# EAGLE design tinynumitronboard-extended_iv6 (EAGLE 7.7.0)
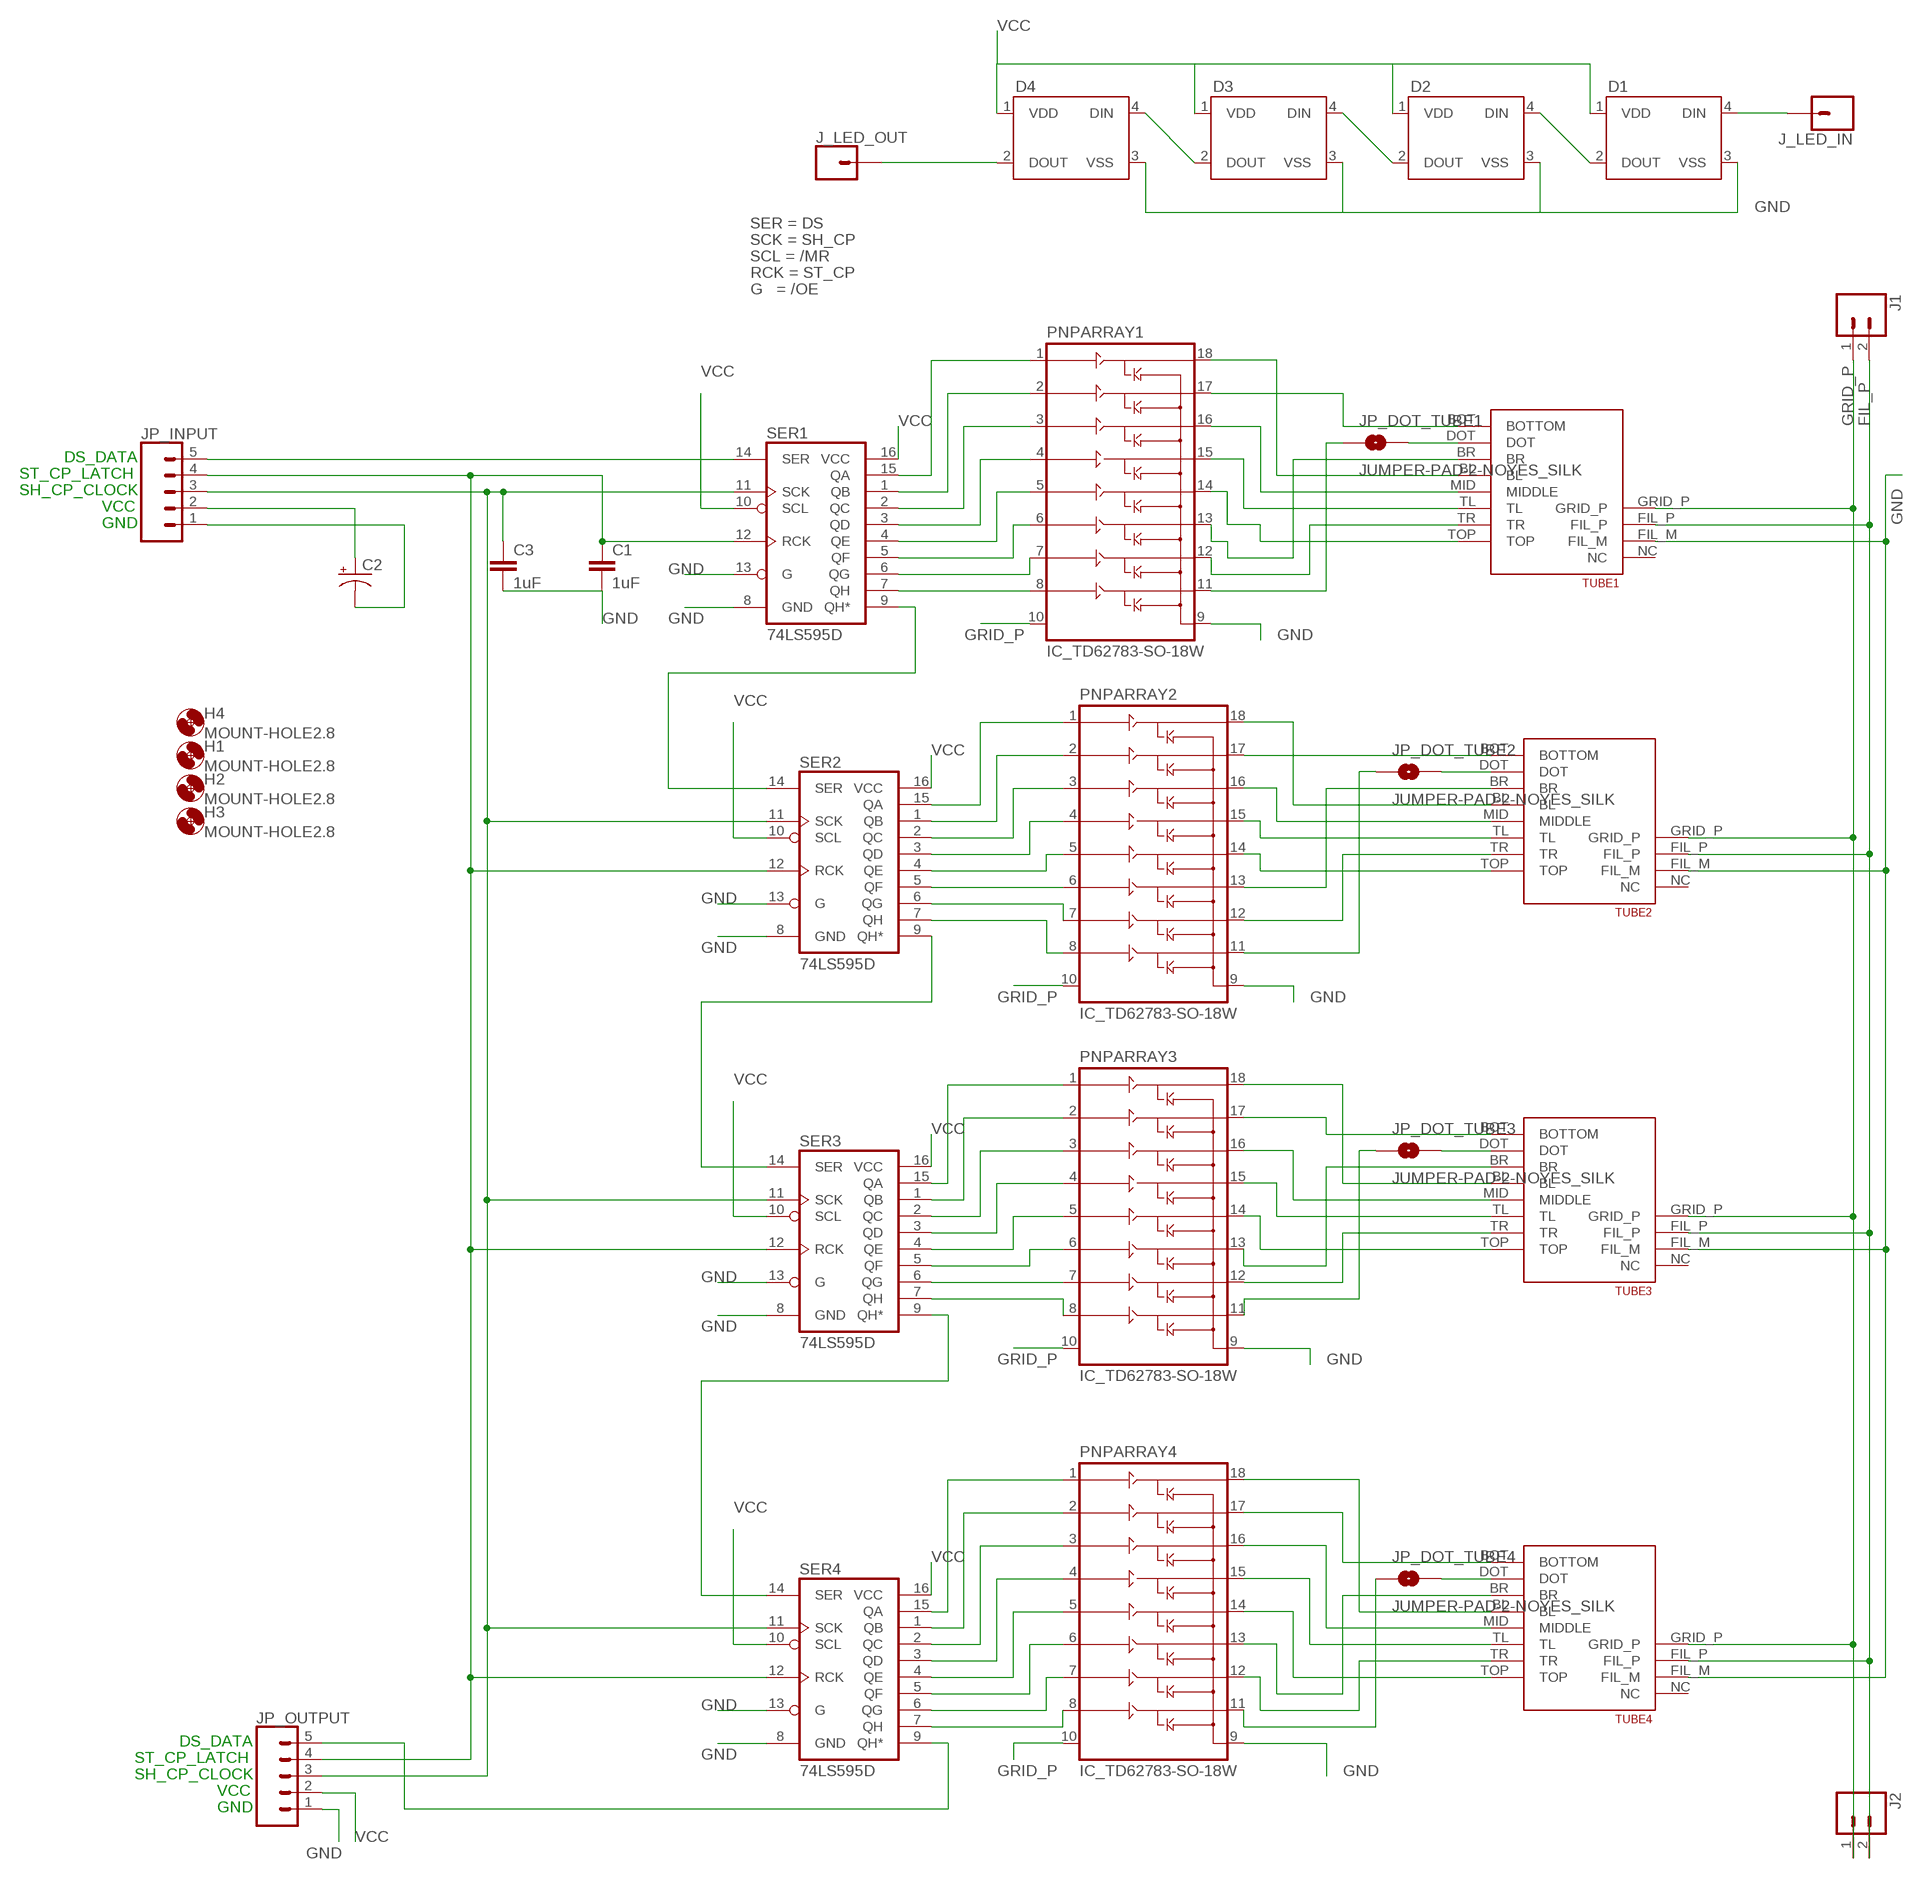
[diagram p0: schematic, sheet 1]

## Parts
C1  1uF  C-EUC1206  [C1206]
C2  CAP_POLD  [PANASONIC_D]
C3  1uF  C-EUC1206  [C1206]
D1  WS2812B  [WS2812B]
D2  WS2812B  [WS2812B]
D3  WS2812B  [WS2812B]
D4  WS2812B  [WS2812B]
H1  MOUNT-HOLE2.8  [2,8]
H2  MOUNT-HOLE2.8  [2,8]
H3  MOUNT-HOLE2.8  [2,8]
H4  MOUNT-HOLE2.8  [2,8]
J1  CONN_021X02_NO_SILK  [1X02_NO_SILK]
J2  CONN_021X02_NO_SILK  [1X02_NO_SILK]
J_LED_IN  CONN_01  [1X01]
J_LED_OUT  CONN_01  [1X01]
JP_DOT_TUBE1  JUMPER-PAD-2-NOYES_SILK  [PAD-JUMPER-2-NO_YES_SILK]
JP_DOT_TUBE2  JUMPER-PAD-2-NOYES_SILK  [PAD-JUMPER-2-NO_YES_SILK]
JP_DOT_TUBE3  JUMPER-PAD-2-NOYES_SILK  [PAD-JUMPER-2-NO_YES_SILK]
JP_DOT_TUBE4  JUMPER-PAD-2-NOYES_SILK  [PAD-JUMPER-2-NO_YES_SILK]
JP_INPUT  CONN_05NO_SILK  [1X05_NO_SILK]
JP_OUTPUT  CONN_05NO_SILK  [1X05_NO_SILK]
PNPARRAY1  IC_TD62783-SO-18W  [SO-18L]
PNPARRAY2  IC_TD62783-SO-18W  [SO-18L]
PNPARRAY3  IC_TD62783-SO-18W  [SO-18L]
PNPARRAY4  IC_TD62783-SO-18W  [SO-18L]
SER1  74LS595D  [SO16]
SER2  74LS595D  [SO16]
SER3  74LS595D  [SO16]
SER4  74LS595D  [SO16]
TUBE1  IV6_NUMITRONLARGE  [IV6_NUMITRON_PAC_LARGE]
TUBE2  IV6_NUMITRONLARGE  [IV6_NUMITRON_PAC_LARGE]
TUBE3  IV6_NUMITRONLARGE  [IV6_NUMITRON_PAC_LARGE]
TUBE4  IV6_NUMITRONLARGE  [IV6_NUMITRON_PAC_LARGE]

## Nets
FIL_P: J1.2 J2.2 TUBE1.FIL_P TUBE2.FIL_P TUBE3.FIL_P TUBE4.FIL_P
GND: C1.2 C2.- C3.2 D1.3(VSS) D2.3(VSS) D3.3(VSS) D4.3(VSS) JP_INPUT.1 JP_OUTPUT.1 PNPARRAY1.9(GND) PNPARRAY2.9(GND) PNPARRAY3.9(GND) PNPARRAY4.9(GND) SER1.8(GND) SER1.13(G) SER2.8(GND) SER2.13(G) SER3.8(GND) SER3.13(G) SER4.8(GND) SER4.13(G) TUBE1.FIL_M TUBE2.FIL_M TUBE3.FIL_M TUBE4.FIL_M
GRID_P: J1.1 J2.1 PNPARRAY1.10(VS) PNPARRAY2.10(VS) PNPARRAY3.10(VS) PNPARRAY4.10(VS) TUBE1.GRID_P TUBE2.GRID_P TUBE3.GRID_P TUBE4.GRID_P
N$1: PNPARRAY1.5(IN5) SER1.4(QE)
N$2: PNPARRAY1.4(IN4) SER1.3(QD)
N$3: PNPARRAY1.3(IN3) SER1.2(QC)
N$4: PNPARRAY1.2(IN2) SER1.1(QB)
N$5: PNPARRAY1.1(IN1) SER1.15(QA)
N$6: PNPARRAY1.6(IN6) SER1.5(QF)
N$7: PNPARRAY1.7(IN7) SER1.6(QG)
N$8: PNPARRAY1.8(IN8) SER1.7(QH)
N$9: D1.2(DOUT) D2.4(DIN)
N$10: D2.2(DOUT) D3.4(DIN)
N$11: D3.2(DOUT) D4.4(DIN)
N$12: D1.4(DIN) J_LED_IN.1
N$13: SER2.9(QH*) SER3.14(SER)
N$14: PNPARRAY2.18(OUT1) TUBE2.BL
N$15: PNPARRAY1.18(OUT1) TUBE1.BL
N$16: PNPARRAY2.17(OUT2) TUBE2.BOT(BOTTOM)
N$17: PNPARRAY2.16(OUT3) TUBE2.MID(MIDDLE)
N$18: PNPARRAY1.17(OUT2) TUBE1.BOT(BOTTOM)
N$19: PNPARRAY1.16(OUT3) TUBE1.MID(MIDDLE)
N$23: SER1.9(QH*) SER2.14(SER)
N$24: PNPARRAY4.18(OUT1) TUBE4.BL
N$25: PNPARRAY4.17(OUT2) TUBE4.BOT(BOTTOM)
N$26: PNPARRAY4.16(OUT3) TUBE4.MID(MIDDLE)
N$27: PNPARRAY4.15(OUT4) TUBE4.TL
N$28: PNPARRAY4.14(OUT5) TUBE4.TOP
N$29: PNPARRAY4.13(OUT6) TUBE4.BR
N$30: PNPARRAY4.12(OUT7) TUBE4.TR
N$31: JP_DOT_TUBE4.1 PNPARRAY4.11(OUT8)
N$32: PNPARRAY4.1(IN1) SER4.15(QA)
N$33: PNPARRAY4.2(IN2) SER4.1(QB)
N$34: PNPARRAY4.3(IN3) SER4.2(QC)
N$35: PNPARRAY4.4(IN4) SER4.3(QD)
N$36: PNPARRAY4.5(IN5) SER4.4(QE)
N$37: PNPARRAY4.6(IN6) SER4.5(QF)
N$38: PNPARRAY1.15(OUT4) TUBE1.TL
N$39: PNPARRAY2.15(OUT4) TUBE2.TL
N$40: PNPARRAY2.14(OUT5) TUBE2.TOP
N$41: PNPARRAY2.13(OUT6) TUBE2.BR
N$42: PNPARRAY2.12(OUT7) TUBE2.TR
N$43: JP_DOT_TUBE2.1 PNPARRAY2.11(OUT8)
N$44: PNPARRAY2.1(IN1) SER2.15(QA)
N$45: PNPARRAY2.2(IN2) SER2.1(QB)
N$46: PNPARRAY2.3(IN3) SER2.2(QC)
N$47: PNPARRAY2.4(IN4) SER2.3(QD)
N$48: PNPARRAY2.5(IN5) SER2.4(QE)
N$49: PNPARRAY2.6(IN6) SER2.5(QF)
N$50: PNPARRAY2.7(IN7) SER2.6(QG)
N$51: PNPARRAY2.8(IN8) SER2.7(QH)
N$52: PNPARRAY4.7(IN7) SER4.6(QG)
N$53: SER3.9(QH*) SER4.14(SER)
N$54: PNPARRAY3.18(OUT1) TUBE3.BL
N$55: PNPARRAY1.14(OUT5) TUBE1.TOP
N$56: PNPARRAY1.13(OUT6) TUBE1.BR
N$57: PNPARRAY1.12(OUT7) TUBE1.TR
N$58: PNPARRAY3.17(OUT2) TUBE3.BOT(BOTTOM)
N$59: JP_DOT_TUBE1.1 PNPARRAY1.11(OUT8)
N$60: PNPARRAY3.16(OUT3) TUBE3.MID(MIDDLE)
N$61: PNPARRAY3.15(OUT4) TUBE3.TL
N$62: PNPARRAY3.14(OUT5) TUBE3.TOP
N$63: PNPARRAY3.13(OUT6) TUBE3.BR
N$64: PNPARRAY3.12(OUT7) TUBE3.TR
N$65: JP_DOT_TUBE3.1 PNPARRAY3.11(OUT8)
N$66: PNPARRAY3.1(IN1) SER3.15(QA)
N$67: PNPARRAY3.2(IN2) SER3.1(QB)
N$68: PNPARRAY3.3(IN3) SER3.2(QC)
N$69: PNPARRAY3.4(IN4) SER3.3(QD)
N$70: PNPARRAY3.5(IN5) SER3.4(QE)
N$71: PNPARRAY3.6(IN6) SER3.5(QF)
N$72: PNPARRAY3.7(IN7) SER3.6(QG)
N$73: PNPARRAY3.8(IN8) SER3.7(QH)
N$74: PNPARRAY4.8(IN8) SER4.7(QH)
N$75: JP_DOT_TUBE2.2 TUBE2.DOT
N$76: JP_DOT_TUBE3.2 TUBE3.DOT
N$79: JP_DOT_TUBE1.2 TUBE1.DOT
N$80: JP_DOT_TUBE4.2 TUBE4.DOT
N$107: JP_OUTPUT.5 SER4.9(QH*)
N$112: D4.2(DOUT) J_LED_OUT.1
RCK: C1.1 JP_INPUT.4 JP_OUTPUT.4 SER1.12(RCK) SER2.12(RCK) SER3.12(RCK) SER4.12(RCK)
SCK: C3.1 JP_INPUT.3 JP_OUTPUT.3 SER1.11(SCK) SER2.11(SCK) SER3.11(SCK) SER4.11(SCK)
SER: JP_INPUT.5 SER1.14(SER)
VCC: C2.+ D1.1(VDD) D2.1(VDD) D3.1(VDD) D4.1(VDD) JP_INPUT.2 JP_OUTPUT.2 SER1.10(SCL) SER1.16(VCC) SER2.10(SCL) SER2.16(VCC) SER3.10(SCL) SER3.16(VCC) SER4.10(SCL) SER4.16(VCC)
Unconnected: TUBE1.NC TUBE2.NC TUBE3.NC TUBE4.NC

## Notes on the sheet
- SER = DS
- SCK = SH_CP
- SCL = /MR
- RCK = ST_CP
- G   = /OE
- DS_DATA
- ST_CP_LATCH
- SH_CP_CLOCK
- VCC
- GND
- DS_DATA
- ST_CP_LATCH
- SH_CP_CLOCK
- VCC
- GND

## Library data of the parts
C1 C3 = resistor:C-EU: CAPACITOR, European symbol
C2 = SparkFun-Passives:CAP_POL: Capacitor Polarized These are standard SMD and PTH capacitors. Normally 10uF, 47uF, and 100uF in electrolytic and tantalum varieties. Always verify the external diameter of the through hole cap, it varies with capacity, voltage, and manufacturer. The EIA devices should be standard.
D1-D4 = SparkFun-LED:WS2812B: WS2812B - Intelligent control LED integrated light source Technical Specifications: Power Supply Voltage (VDD): 3.5 to 5.3 V Input Voltage (VI): -0.5 to VDD+0.5 V Operating Junction Temperature (Topt): -25°C to +80°C Storage Temperature Range (Tstg): -55°C to +150°C; PROD_ID: DIO-12503
H1-H4 = holes:MOUNT-HOLE: MOUNTING HOLE with drill center marker
J1 J2 = SparkFun-Connectors:CONN_02: Multi connection point. Often used as Generic Header-pin footprint for 0.1 inch spaced/style header connections On any of the 0.1 inch spaced packages, you can populate with these: Break Away Headers - Straight <https://www.sparkfun.com/products/116> (PRT-00116) Break Away Male Headers - Right Angle <https://www.sparkfun.com/products/553> (PRT-00553) Female Headers <https://www.sparkfun.com/products/115> (PRT-00115) Break Away Headers - Machine Pin <https://www.sparkfun.com/products/117> (PRT-00117) Break Away Female Headers - Swiss Machine Pin <https://www.sparkfun.com/products/743> (PRT-00743) For SCREWTERMINALS and SPRING TERMINALS visit here: Screw Terimnals on SparkFun.com <https://www.sparkfun.com/search/results?term=Screw+Terminals> (5mm/3.5mm/2.54mm spacing) This device is also useful as a general connection point to wire up your design to another part of your project. Our various solder wires solder well into these plated through hole pads. Hook-Up Wire - Assortment (Stranded, 22 AWG) <https://www.sparkfun.com/products/11375> (PRT-11375) Hook-Up Wire - Assortment (Solid Core, 22 AWG) <https://www.sparkfun.com/products/11367> (PRT-11367) View the entire wire category on our website here <https://www.sparkfun.com/categories/141> Special notes: Molex polarized connector foot print use with: PRT-08233 with associated crimp pins and housings. 2.54_SCREWTERM for use with PRT-10571. 3.5mm Screw Terminal footprints for PRT-08084 5mm Screw Terminal footprints for use with PRT-08432
J_LED_IN J_LED_OUT = SparkFun-Connectors:CONN_01: Single connection point. Often used as Generic Header-pin footprint for 0.1 inch spaced/style header connections On any of the 0.1 inch spaced packages, you can populate with these: Break Away Headers - Straight <https://www.sparkfun.com/products/116> (PRT-00116) Break Away Male Headers - Right Angle <https://www.sparkfun.com/products/553> (PRT-00553) Female Headers <https://www.sparkfun.com/products/115> (PRT-00115) Break Away Headers - Machine Pin <https://www.sparkfun.com/products/117> (PRT-00117) Break Away Female Headers - Swiss Machine Pin <https://www.sparkfun.com/products/743> (PRT-00743) This device is also useful as a general connection point to wire up your design to another part of your project. Our various solder wires solder well into these plated through hole pads. Hook-Up Wire - Assortment (Stranded, 22 AWG) <https://www.sparkfun.com/products/11375> (PRT-11375) Hook-Up Wire - Assortment (Solid Core, 22 AWG) <https://www.sparkfun.com/products/11367> (PRT-11367) View the entire wire category on our website here <https://www.sparkfun.com/categories/141> Special notes: SMTSO-256-ET is a "flush mount" nut for a 4-40 screw. We mostly use this on specialty testbeds; it is a nice way to connect hardware to your PCB at an adjustable hieght. Also note, the SNAP packages are for using a snappable style connector. We sell a baggie of snaps and they are also used on two LilyPad designs: Snap Assortment - 30 pack (male and female) <https://www.sparkfun.com/products/11347> (DEV-11347) LilyPad Arduino SimpleSnap <https://www.sparkfun.com/products/10941> (DEV-10941) LilyPad SimpleSnap Protoboard <https://www.sparkfun.com/products/10940> (DEV-10940)
JP_DOT_TUBE1-JP_DOT_TUBE4 = SparkFun-Passives:JUMPER-PAD-2-NO
JP_INPUT JP_OUTPUT = SparkFun-Connectors:CONN_05: Multi connection point. Often used as Generic Header-pin footprint for 0.1 inch spaced/style header connections On any of the 0.1 inch spaced packages, you can populate with these: Break Away Headers - Straight <https://www.sparkfun.com/products/116> (PRT-00116) Break Away Male Headers - Right Angle <https://www.sparkfun.com/products/553> (PRT-00553) Female Headers <https://www.sparkfun.com/products/115> (PRT-00115) Break Away Headers - Machine Pin <https://www.sparkfun.com/products/117> (PRT-00117) Break Away Female Headers - Swiss Machine Pin <https://www.sparkfun.com/products/743> (PRT-00743) For SCREWTERMINALS and SPRING TERMINALS visit here: Screw Terimnals on SparkFun.com <https://www.sparkfun.com/search/results?term=Screw+Terminals> (5mm/3.5mm/2.54mm spacing) This device is also useful as a general connection point to wire up your design to another part of your project. Our various solder wires solder well into these plated through hole pads. Hook-Up Wire - Assortment (Stranded, 22 AWG) <https://www.sparkfun.com/products/11375> (PRT-11375) Hook-Up Wire - Assortment (Solid Core, 22 AWG) <https://www.sparkfun.com/products/11367> (PRT-11367) View the entire wire category on our website here <https://www.sparkfun.com/categories/141> Special notes: Molex polarized connector foot print use with SKU : PRT-08231 with associated crimp pins and housings. 1MM SMD Version SKU: PRT-10208
PNPARRAY1-PNPARRAY4 = dp_devices:IC_TD62783: 8 Channel High voltage Source driver Mfr no: TD62783 TD62783AFG <http://www.digikey.com/product-detail/en/TD62783AFG%28O,S%29/TD62783AFG%28OS%29-ND/871116>
SER1-SER4 = SparkFun-DigitalIC:74*595: 8-bit SHIFT REGISTER, output latch; PROD_ID: IC-07875
TUBE1-TUBE4 = kalshagar:IV6_NUMITRON: Regular version with small footprint

## Board
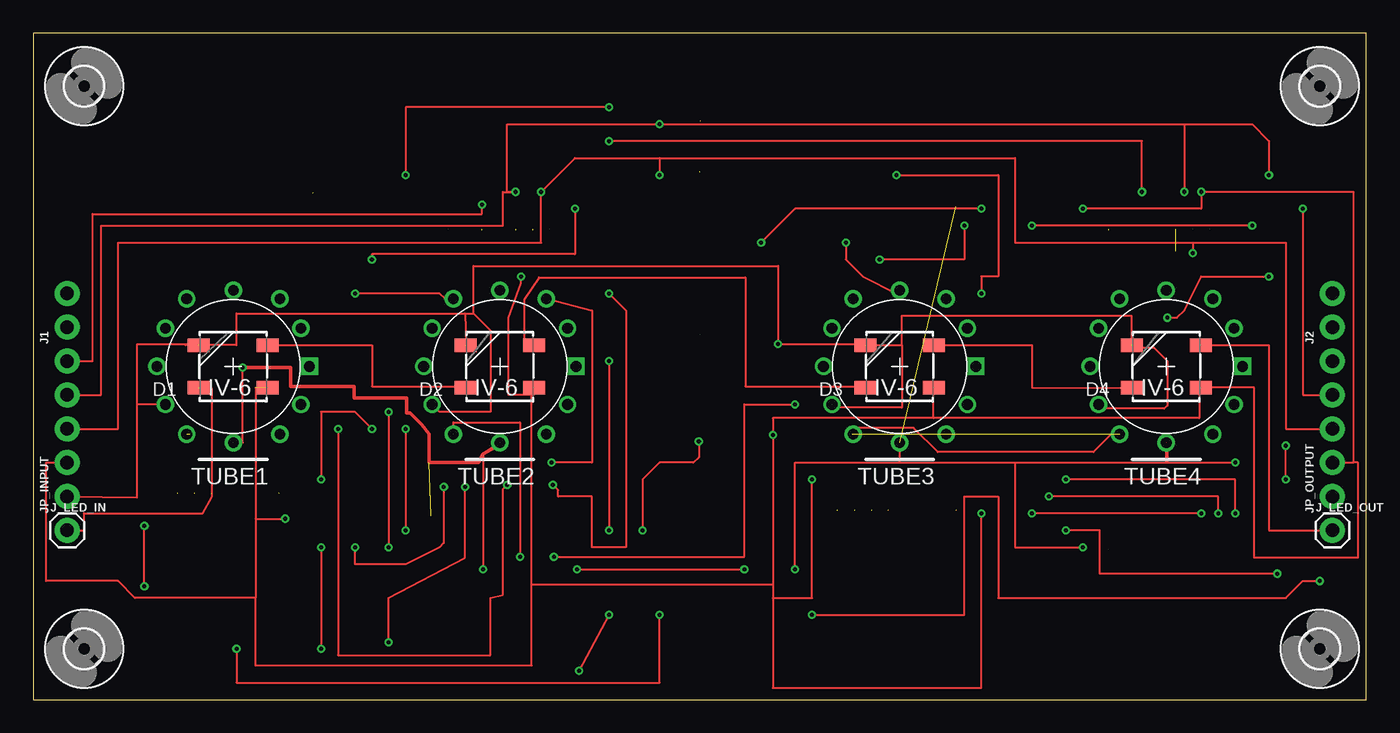
[diagram p1: board, top side]
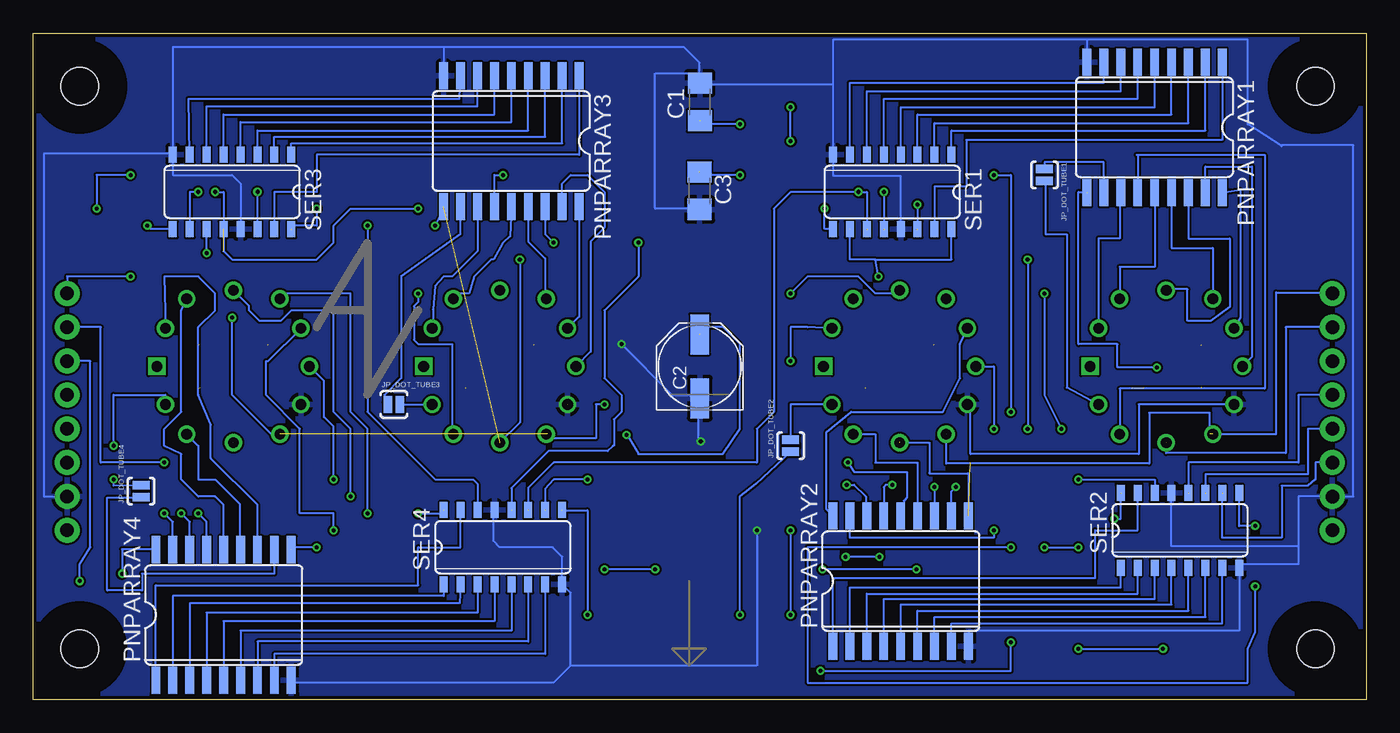
[diagram p2: board, bottom side, seen from below]

Size 100 x 50 mm. Coordinates in mm from the lower left corner, seen from the top.
Outline: 0,0 100,0 100,50 0,50 0,0
Copper layers (1*16): Top 0.035mm / dielectric 1.5mm / Bottom 0.035mm
Design rules "SeeedStudio_2layer_DRU_no_angle_20140221": minimum track width 6mil, minimum drill 12mil, track to track 6mil, track to pad 6mil, pad to pad 6mil, via to via 6mil, smd to smd 0mil, copper to edge 10mil, drill to drill 10mil, minimum pad ring 10mil, minimum via ring 6mil, stop-mask expansion 2mil, vias tented up to drill 100mil, thermal gap 10mil

### Footprints (pad centres in the part's own frame; a part is rotated, then mirrored left to right if it is on the bottom)
C1206 = smd 1.6 x 1.8: 1 -1.4,0; 2 1.4,0
PANASONIC_D = smd 3 x 1.4: + 2.4,0; - -2.4,0
WS2812B = smd 1.651 x 1: 1 -2.577,1.6; 2 -2.577,-1.6; 3 2.577,-1.6; 4 2.577,1.6
2,8 = hole 2.8: 0,0
1X02_NO_SILK = drill 1.016 pad 1.88: 1 0,0; 2 2.54,0
1X01 = drill 1.016 pad 1.88: 1 0,0
PAD-JUMPER-2-NO_YES_SILK = smd 0.635 x 1.27: 1 -0.45,0; 2 0.45,0
1X05_NO_SILK = drill 1.016 pad 1.88: 1 0,0; 2 2.54,0; 3 5.08,0; 4 7.62,0; 5 10.16,0
SO-18L = smd 0.66 x 2.032: 1 -4.445,-4.902; 2 -3.175,-4.902; 3 -1.905,-4.902; 4 -0.635,-4.902; 5 0.635,-4.902; 6 1.905,-4.902; 7 3.175,-4.902; 8 4.445,-4.902; 9 5.715,-4.902; 10 5.715,4.902; 11 4.445,4.902; 12 3.175,4.902; 13 1.905,4.902; 14 0.635,4.902; 15 -0.635,4.902; 16 -1.905,4.902; 17 -3.175,4.902; 18 -4.445,4.902
SO16 = smd 0.6 x 1.2: 1 -4.445,-2.8; 2 -3.175,-2.8; 3 -1.905,-2.8; 4 -0.635,-2.8; 5 0.635,-2.8; 6 1.905,-2.8; 7 3.175,-2.8; 8 4.445,-2.8; 9 4.445,2.8; 10 3.175,2.8; 11 1.905,2.8; 12 0.635,2.8; 13 -0.635,2.8; 14 -1.905,2.8; 15 -3.175,2.8; 16 -4.445,2.8
IV6_NUMITRON_PAC_LARGE = drill 0.8: BL -5.08,2.857; BOT -5.715,0; BR 3.493,-5.08; DOT 5.08,-2.857; FIL_M -5.08,-2.857; FIL_P -3.493,-5.08; GRID_P 0,-5.715; MID 0,5.715; TL -3.493,5.08; TOP 3.493,5.08; TR 5.08,2.857 | drill 0.8 square: NC 5.715,0

### Placement (x,y rotation side)
C1  50,44.85 90 bottom
C2  50,25 90 bottom
C3  50.01,38.18 270 bottom
D1  15,25 180 top
D2  35,25 180 top
D3  65,25 180 top
D4  85,25 180 top
H1  3.81,46.04 0 top
H2  96.52,46.04 0 top
H3  96.52,3.81 0 top
H4  3.81,3.81 0 top
J1  2.54,27.94 90 top
J2  97.47,27.94 90 top
J_LED_IN  2.54,12.7 0 top
J_LED_OUT  97.47,12.7 0 top
JP_DOT_TUBE1  24.13,39.37 270 bottom
JP_DOT_TUBE2  43.18,19.05 90 bottom
JP_DOT_TUBE3  72.95,22.15 0 bottom
JP_DOT_TUBE4  91.92,15.64 90 bottom
JP_INPUT  2.54,15.24 90 top
JP_OUTPUT  97.47,15.24 90 top
PNPARRAY1  15.24,42.94 180 bottom
PNPARRAY2  35.56,8.89 0 bottom
PNPARRAY3  63.5,41.91 180 bottom
PNPARRAY4  86.36,6.35 0 bottom
SER1  35.56,38.1 180 bottom
SER2  13.97,12.7 0 bottom
SER3  85.09,38.1 180 bottom
SER4  64.77,11.43 0 bottom
TUBE1  15,25 0 top
TUBE2  35,25 0 top
TUBE3  65,25 0 top
TUBE4  85,25 0 top
U$1  [SNOW1_1000X500]  0,0 0 top

### Tracks (layer width: path | path; a pad name or v marks a point on that pad's centre or on a via)
FIL_P  (via drill 0.3)  (6 unrouted)
  Top 0.152: v85.09,28.65 85.8,28.65 86.36,29.21 87.63,31.75 v92.71,31.75 | v36.51,10.72 36.51,20.8 31.51,20.8 TUBE2.FIL_P | v39.05,10.72 53.34,10.72 53.34,22.15 v57.15,22.15
  Bottom 0.152: v92.71,31.75 97.47,31.75 J2.2 | TUBE4.FIL_P 82.15,19.92 85.09,22.86 v85.09,28.65 | TUBE2.FIL_P 31.51,17.7 16.27,17.7 16.27,21.51 11.75,21.51 11.75,19.92 6.75,19.92 6.75,30.56 2.7,30.56 2.7,30.48 J1.2 | v36.51,10.72 v39.05,10.72 | v57.15,22.15 57.78,22.15 57.78,19.61 61.44,19.61 61.44,19.92
GND  (via drill 0.3)  (5 unrouted)
  Top 0.152: JP_INPUT.1 7.78,15.16 7.78,22.15 | 7.78,22.15 7.78,26.67 11.43,26.67 | 11.43,26.67 12.38,26.67 12.38,26.59 | 62.47,26.59 65.17,26.59 | 65.17,26.59 65.17,28.81 82.39,28.81 82.39,26.91 | 82.39,26.91 82.39,26.59 | 97.79,15.32 JP_OUTPUT.1 | TUBE1.FIL_M 7.78,22.15 | 32.38,28.97 15.24,28.97 15.24,26.59 11.43,26.59 11.43,26.67 | 32.38,28.97 32.46,26.59 | 32.38,28.97 33.02,28.97 | 33.02,28.97 33.02,32.54 55.88,32.54 v55.88,26.67 62.39,26.67 62.39,26.59 | 65.17,26.59 65.17,21.91 60.17,21.91 TUBE3.FIL_M | v49.93,19.37 49.93,18.18 49.53,17.78 46.99,17.78 45.72,16.51 v45.72,12.7 | 82.39,26.91 82.87,26.43 84.06,26.43 85.09,25.4 85.09,22.07 84.85,21.83 80.25,21.83 TUBE4.FIL_M | TUBE2.FIL_M 30.48,21.59 34.29,21.59 34.29,27.7 33.02,28.97
  Bottom 0.152: 5.08,11.51 5.08,15.24 JP_INPUT.1 0.95,15.24 0.95,41.59 6.35,41.59 6.35,41.51 8.89,43.18 8.89,49.53 20.95,49.53 | 5.08,11.51 5.08,10.16 9.53,10.16 9.53,5.16 29.84,5.16 29.84,3.97 | 20.95,49.53 40.01,49.53 40.01,46.2 | 40.01,46.2 40.01,39.29 34.92,39.29 34.92,35.24 | 20.95,49.53 20.95,48.1 | 40.01,46.2 50.01,46.2 50.01,46.99 | 5.08,11.51 14.61,11.51 14.61,15.48 | v55.88,26.67 52.07,22.86 50.8,22.86 | 50.8,22.86 50.24,22.86 50.01,22.62 | 50.01,46.99 50.01,47.78 51.2,48.97 69.22,48.97 | 69.22,48.97 69.22,46.83 | 69.22,48.97 89.53,48.97 89.53,40.96 | 89.53,40.96 99.22,40.96 99.22,15.24 JP_OUTPUT.1 | 89.53,40.96 89.53,39.37 85.09,39.37 84.45,38.73 84.45,35.32 | v49.93,19.37 50.09,19.53 50.09,22.15 50.8,22.86 | v45.72,12.7 45.72,2.54 59.69,2.54 | 59.69,2.54 59.69,8.02 60.33,8.65 60.33,10.72 61.04,11.43 65.01,11.43 65.48,11.91 65.48,14.13 65.41,14.21 | 59.69,2.54 60.96,1.27 80.49,1.27 80.64,1.43 | 50.01,36.75 50.8,36.83 53.34,36.83 53.34,46.99 50.01,46.99
  pour Bottom: -1.27,50.8 101.6,50.8 101.6,-1.27 -1.27,-1.27
GRID_P  (via drill 0.3)  (9 unrouted)
  Top 0.152: TUBE2.GRID_P 33.73,18.41 v33.73,9.76 | v40.8,9.76 v53.34,9.76 | v57.15,9.76 57.15,17.78 65.01,17.78 | 65.01,17.78 TUBE3.GRID_P | 65.01,17.78 73.66,17.78 | 73.66,17.78 85.01,17.78 TUBE4.GRID_P 85.09,19.29 85.09,17.78 v90.17,17.78 | 73.66,17.78 73.66,11.43 v78.74,11.43 | TUBE1.GRID_P 15.72,19.29 v15.72,24.92
  Top 0.254: v15.72,24.92 19.29,24.92 19.29,23.5 24.05,23.5 24.05,22.62 28.02,22.62 28.02,21.51 28.26,21.51 29.13,20.64 29.69,19.92 29.69,17.78 33.42,17.78 33.73,18.41 34.69,18.97 TUBE2.GRID_P
  Bottom 0.152: J2.1 94.93,27.94 94.93,17.78 v90.17,17.78 | v33.73,9.76 v40.8,9.76 | v53.34,9.76 v57.15,9.76 | v78.74,11.43 80.64,11.43 80.64,11.27 | v15.72,24.92 18.65,24.92 18.65,26.67 21.59,26.67 21.59,38.1 20.95,38.1 20.95,38.02 | J1.1 6.03,27.94 6.03,18.49 15,18.49 TUBE1.GRID_P
N$1
  Bottom 0.152: SER1.4 34.92,44.45 15.88,44.45 PNPARRAY1.5
N$2
  Bottom 0.152: SER1.3 33.66,43.89 14.61,43.89 PNPARRAY1.4
N$3
  Bottom 0.152: SER1.2 32.38,43.26 13.34,43.26 PNPARRAY1.3
N$4
  Bottom 0.152: SER1.1 31.11,42.7 12.06,42.7 PNPARRAY1.2
N$5
  Bottom 0.152: PNPARRAY1.1 10.79,41.99 30,41.99 30,38.5 32.38,38.5 SER1.15
N$6
  Bottom 0.152: SER1.5 36.2,45.09 17.14,45.09 PNPARRAY1.6
N$7
  Bottom 0.152: SER1.6 37.47,45.64 18.41,45.64 PNPARRAY1.7
N$8
  Bottom 0.152: SER1.7 38.73,46.28 19.68,46.28 PNPARRAY1.8
N$9
  Top 0.152: D1.2 25.4,26.59 25.4,23.5 32.46,23.5 D2.4
N$10
  Top 0.152: D3.4 62.39,23.5 53.42,23.5 53.42,31.67 37.94,31.67 36.83,30 36.83,26.67 D2.2
N$11
  Top 0.152: D3.2 74.93,26.59 74.93,23.42 D4.4
N$12  (1 unrouted)
  Top 0.152: J_LED_IN.1 3.81,12.7 3.81,13.97 12.7,13.97 13.41,15.24 13.41,23.34 12.38,23.34 12.38,23.42
N$13  (via drill 0.3)
  Top 0.152: v83.19,38.1 83.19,41.91 v43.18,41.91 | v43.18,44.45 27.94,44.45 v27.94,39.37 | v26.67,21.59 v26.67,11.43 | v8.33,8.49 v8.33,13.02
  Bottom 0.152: SER3.14 v83.19,38.1 | v43.18,41.91 v43.18,44.45 | v27.94,39.37 26.67,39.37 v26.67,21.59 | v26.67,11.43 41.91,11.43 41.91,1.27 8.89,1.27 8.89,3.81 8.33,5.08 v8.33,8.49 | v8.33,13.02 9.53,13.02 SER2.9
N$14
  Bottom 0.152: PNPARRAY2.18 39.93,13.81 40.01,13.81 40.48,14.29 40.48,20.08 38.66,21.59 31.75,21.59 30.48,24.13 30.48,26.67 TUBE2.BL
N$15
  Bottom 0.152: PNPARRAY1.18 9.45,38.26 9.45,28.65 TUBE1.BL
N$16  (via drill 0.3)
  Top 0.152: v27.94,20.32 v27.94,12.7
  Bottom 0.152: TUBE2.BOT 27.94,25 v27.94,20.32 | v27.94,12.7 27.94,12.14 38.73,12.14 PNPARRAY2.17
N$17  (via drill 0.3)
  Top 0.152: v43.18,30.48 44.45,29.21 44.45,11.43 41.91,11.43 41.91,15.24 39.37,15.24 39.37,15.72 v38.97,16.11
  Bottom 0.152: TUBE2.MID 35.32,30.72 35.56,30.48 36.83,30.48 38.1,31.75 41.91,31.75 v43.18,30.48 | v38.97,16.11 38.42,16.11 37.54,15.24 37.54,13.89 PNPARRAY2.16
N$18
  Bottom 0.152: PNPARRAY1.17 12.06,40.01 8.57,40.01 8.57,25.72 TUBE1.BOT
N$19
  Bottom 0.152: PNPARRAY1.16 13.34,34.61 10.24,34.61 10.24,29.45 11.67,28.42 13.41,28.42 13.41,30.8 15,30.8 TUBE1.MID
N$23  (via drill 0.3)
  Top 0.152: v40.64,36.83 40.64,33.42 25.4,33.42 v25.4,33.02 | v25.4,20.32 24.13,21.59 21.59,21.59 v21.59,16.51
  Bottom 0.152: SER1.9 40.64,35.32 v40.64,36.83 | v25.4,33.02 v25.4,20.32 | v21.59,16.51 15.88,16.51 SER2.14
N$24  (via drill 0.3)
  Top 0.152: v93.34,9.45 80.01,9.45 80.01,12.7 v77.47,12.7
  Bottom 0.152: PNPARRAY4.18 93.34,11.27 v93.34,9.45 | v77.47,12.7 77.47,13.97 80.01,13.97 80.01,20.32 82.55,22.86 82.55,25.4 82.39,25.4 TUBE4.BL
N$25  (via drill 0.3)
  Top 0.152: v90.17,13.97 90.17,16.51 v77.47,16.51
  Bottom 0.152: PNPARRAY4.17 89.53,13.34 v90.17,13.97 | v77.47,16.51 77.47,20.48 78.18,21.19 78.18,23.89 TUBE4.BOT
N$26  (via drill 0.3)
  Top 0.152: v88.9,13.97 88.9,15.24 v76.2,15.24
  Bottom 0.152: PNPARRAY4.16 88.27,13.34 v88.9,13.97 | v76.2,15.24 76.2,20.32 77.47,21.59 77.47,29.21 80.64,29.21 81.44,28.42 83.03,28.42 83.82,29.21 83.82,29.53 TUBE4.MID
N$27  (via drill 0.3)
  Top 0.152: v87.63,13.97 v74.93,13.97
  Bottom 0.152: PNPARRAY4.15 87,13.34 v87.63,13.97 | v74.93,13.97 74.93,20.32 76.2,21.59 76.2,30.48 81.12,30.48 TUBE4.TL
N$28
  Bottom 0.152: PNPARRAY4.14 85.72,14.61 86.36,15.24 87.63,15.24 88.9,16.51 88.9,18.41 90.17,19.05 90.17,20.32 88.9,21.59 88.9,29.21 TUBE4.TOP
N$29
  Bottom 0.152: TUBE4.BR 87.63,19.05 87.63,16.51 86.36,16.51 84.53,14.68 84.53,11.35 PNPARRAY4.13
N$30
  Bottom 0.152: PNPARRAY4.12 83.19,14.61 86.68,18.1 86.68,20.64 87.63,22.86 87.63,27.94 86.36,29.21 86.36,30.48 87.63,31.75 90.17,31.75 TUBE4.TR
N$31
  Bottom 0.152: PNPARRAY4.11 81.92,9.45 91.84,9.45 91.84,8.18 94.46,8.18 94.46,15.16 JP_DOT_TUBE4.1
N$32
  Bottom 0.152: PNPARRAY4.1 90.81,8.57 71.12,8.57 71.12,11.43 67.94,11.43 SER4.15
N$33
  Bottom 0.152: SER4.1 69.22,7.78 89.53,7.78 PNPARRAY4.2
N$34
  Bottom 0.152: SER4.2 68.02,7.22 88.27,7.22 PNPARRAY4.3
N$35
  Bottom 0.152: SER4.3 66.67,6.51 87,6.51 PNPARRAY4.4
N$36
  Bottom 0.152: SER4.4 65.41,5.87 85.72,5.87 PNPARRAY4.5
N$37
  Bottom 0.152: SER4.5 64.14,5.16 84.45,5.16 PNPARRAY4.6
N$38
  Bottom 0.152: PNPARRAY1.15 14.61,33.89 11.51,33.89 TUBE1.TL
N$39  (via drill 0.3)
  Top 0.152: TUBE2.TL 30.88,30.08 30.48,30.48 v24.13,30.48 | v22.86,20.32 22.86,3.33 34.29,3.33 34.29,7.62 35.24,7.86 35.24,15.8 v35.56,16.11
  Bottom 0.152: v24.13,30.48 24.13,22.86 v22.86,20.32 | v35.56,16.11 36.04,16.11 36.2,15.95 PNPARRAY2.15
N$40  (via drill 0.3)
  Top 0.152: TUBE2.TOP 41.91,29.21 41.91,17.78 v38.89,17.78
  Bottom 0.152: v38.89,17.78 38.42,17.07 34.45,17.07 34.45,15.16 34.69,14.92 PNPARRAY2.14
N$41
  Bottom 0.152: TUBE2.BR 36.83,19.92 36.83,17.78 33.66,17.78 PNPARRAY2.13
N$42  (via drill 0.3)
  Top 0.152: v43.18,25.4 v43.18,12.7 | v43.18,6.35 v40.96,2.14 | v26.67,4.29 26.67,7.62 32.38,10.64 v32.38,15.95
  Bottom 0.152: TUBE2.TR 41.91,27.94 43.18,27.94 v43.18,25.4 | v43.18,12.7 v43.18,6.35 | v40.96,2.14 26.67,2.14 v26.67,4.29 | v32.38,15.95 PNPARRAY2.12
N$43  (via drill 0.3)
  Top 0.152: v30.8,15.95 30.8,11.75 30.48,11.43 27.94,10.16 24.13,10.16 v24.13,11.43 | v21.59,11.43 v21.59,3.81 | v15.24,3.81 15.24,1.27 46.99,1.27 v46.99,6.35
  Bottom 0.152: PNPARRAY2.11 31.11,15.64 v30.8,15.95 | v24.13,11.43 v21.59,11.43 | v21.59,3.81 v15.24,3.81 | v46.99,6.35 46.99,15.24 45.8,16.19 JP_DOT_TUBE2.1
N$44
  Bottom 0.152: PNPARRAY2.1 40.01,9.13 20.32,9.13 20.32,12.7 17.14,12.7 SER2.15
N$45
  Bottom 0.152: PNPARRAY2.2 38.73,8.41 18.41,8.41 SER2.1
N$46
  Bottom 0.152: PNPARRAY2.3 37.47,7.94 17.14,7.94 SER2.2
N$47
  Bottom 0.152: PNPARRAY2.4 36.2,7.54 15.88,7.54 SER2.3
N$48
  Bottom 0.152: PNPARRAY2.5 34.92,7.14 14.61,7.14 SER2.4
N$49
  Bottom 0.152: PNPARRAY2.6 33.66,6.67 13.34,6.67 SER2.5
N$50
  Bottom 0.152: PNPARRAY2.7 32.38,6.19 12.06,6.19 SER2.6
N$51
  Bottom 0.152: PNPARRAY2.8 31.11,5.71 10.79,5.71 SER2.7
N$52
  Bottom 0.152: SER4.6 62.87,4.37 83.19,4.37 PNPARRAY4.7
N$53  (via drill 0.3)
  Top 0.152: v91.44,35.56 v74.93,35.56
  Bottom 0.152: SER3.9 91.2,35.32 v91.44,35.56 | v74.93,35.56 74.93,21.59 69.85,16.51 66.99,16.51 66.67,16.19 SER4.14
N$54
  Bottom 0.152: PNPARRAY3.18 59.05,28.73 TUBE3.BL
N$55
  Bottom 0.152: PNPARRAY1.14 15.88,32.46 18.49,32.46 TUBE1.TOP
N$56
  Bottom 0.152: 17.14,40.88 7.62,40.88 7.62,23.34 18.49,23.34 TUBE1.BR | 17.22,40.88 17.14,40.88 | 17.14,40.88 PNPARRAY1.13
N$57
  Bottom 0.152: PNPARRAY1.12 18.49,38.34 18.49,34.61 20.08,34.61 TUBE1.TR
N$58
  Bottom 0.152: PNPARRAY3.17 60.33,38.73 59.69,39.37 58.42,39.37 57.15,38.1 57.15,35.4 58.18,34.37 58.18,26.11 TUBE3.BOT
N$59
  Bottom 0.152: PNPARRAY1.11 19.68,40.32 24.13,40.32 JP_DOT_TUBE1.1
N$60  (via drill 0.3)
  Top 0.152: v60.96,34.29 60.96,33.02 62.23,31.75 64.77,30.48 TUBE3.MID
  Bottom 0.152: PNPARRAY3.16 61.59,34.92 v60.96,34.29
N$61
  Bottom 0.152: PNPARRAY3.15 62.87,34.37 61.59,33.1 61.59,30.16 TUBE3.TL
N$62
  Bottom 0.152: PNPARRAY3.14 64.21,34.77 64.77,34.29 65.48,33.02 65.64,33.02 66.91,31.75 67.31,30.48 68.1,30.48 TUBE3.TOP
N$63  (via drill 0.3)
  Top 0.152: v64.77,39.37 72.39,39.37 72.39,31.75 71.12,31.75 v71.12,30.48
  Bottom 0.152: PNPARRAY3.13 65.41,39.37 v64.77,39.37 | v71.12,30.48 71.12,29.84 71.44,29.53 71.44,26.99 71.12,26.67 68.58,26.67 68.58,20 TUBE3.BR
N$64
  Bottom 0.152: PNPARRAY3.12 66.67,33.66 68.58,31.75 69.22,31.75 69.85,31.04 70.01,29.29 70.01,28.42 TUBE3.TR
N$65
  Bottom 0.152: JP_DOT_TUBE3.1 73.66,22.3 73.66,22.86 72.39,24.13 72.39,31.75 67.94,34.92 PNPARRAY3.11
N$66
  Bottom 0.152: PNPARRAY3.1 59.05,40.88 78.74,40.88 78.74,38.1 81.92,38.1 SER3.15
N$67
  Bottom 0.152: SER3.1 80.64,41.75 60.33,41.75 PNPARRAY3.2
N$68
  Bottom 0.152: SER3.2 81.92,42.23 61.59,42.23 PNPARRAY3.3
N$69
  Bottom 0.152: SER3.3 83.19,42.7 62.87,42.7 PNPARRAY3.4
N$70
  Bottom 0.152: SER3.4 84.45,43.34 64.14,43.34 PNPARRAY3.5
N$71
  Bottom 0.152: SER3.5 85.72,43.89 65.41,43.89 PNPARRAY3.6
N$72
  Bottom 0.152: SER3.6 87,44.53 66.67,44.53 PNPARRAY3.7
N$73
  Bottom 0.152: SER3.7 88.34,45.09 68.02,45.09 PNPARRAY3.8
N$74
  Bottom 0.152: SER4.7 61.59,3.41 81.92,3.41 PNPARRAY4.8
N$75
  Bottom 0.152: TUBE2.DOT 43.18,22.15 JP_DOT_TUBE2.2
N$76
  Bottom 0.152: JP_DOT_TUBE3.2 TUBE3.DOT
N$79
  Bottom 0.152: JP_DOT_TUBE1.2 24.05,38.89 24.05,34.92 22.46,34.92 22.46,23.42 TUBE1.DOT
N$80  (via drill 0.3)
  Top 0.152: v93.98,16.51 v93.98,19.05
  Bottom 0.152: JP_DOT_TUBE4.2 93.98,16.03 v93.98,16.51 | v93.98,19.05 93.98,22.86 90.09,22.86 TUBE4.DOT
N$89  (via drill 0.3)
  Top 0.152: v69.85,35.56 69.85,33.02 v63.5,33.02
  Bottom 0.152: 69.22,36.99 69.22,36.83 v69.85,35.56 | v63.5,33.02 63.5,20.8 65.01,19.29
N$96
  Top 0.152: 81.52,19.92 80.88,19.92 79.53,18.57 67.87,18.57 66.04,20.4 61.91,20.4 61.44,19.92
N$107  (via drill 0.3)  (1 unrouted)
  Top 0.152: v58.42,6.35 69.85,6.35 69.85,15.24 72.39,15.24 72.39,7.62 93.98,7.62 95.25,8.89 v96.52,8.89
  Bottom 0.152: 60.33,14.21 58.42,14.21 v58.42,6.35 | v96.52,8.89 96.52,10.16 95.73,11.43 95.73,25.4 JP_OUTPUT.5
N$108
  Bottom 0.152: 9.92,22.15 17.07,22.15 17.07,18.41 29.69,18.41 29.69,22.23 29.92,22.23 29.92,22.15
N$112  (1 unrouted)
  Top 0.152: 87.55,26.59 92.71,26.59 92.71,12.7 J_LED_OUT.1
N$114
  Bottom 0.152: 35,19.29 32.78,19.29 32.78,16.99 29.84,16.99 29.84,13.81
RCK  (via drill 0.3)  (5 unrouted)
  Top 0.152: JP_INPUT.4 5.08,22.86 5.08,35.56 35.24,35.56 35.24,38.1 v36.2,38.1 35.56,38.1 35.56,43.18 v46.99,43.18 86.36,43.18 | 86.36,43.18 v86.36,38.1 | 86.36,43.18 91.44,43.18 92.71,41.91 v92.71,39.37 | v95.25,36.83 95.25,22.86 JP_OUTPUT.4 | v71.12,36.83 57.15,36.83 v54.61,34.29
  Bottom 0.152: v36.2,38.1 36.2,35.24 | v46.99,43.18 50.01,43.18 50.01,43.42 | v86.36,38.1 85.72,38.1 85.72,33.66 85.09,33.02 78.74,33.02 77.47,34.29 77.47,35.56 76.2,36.83 v71.12,36.83 | JP_INPUT.4 5.08,22.86 5.08,17.78 13.34,17.78 13.34,15.48 | v92.71,39.37 95.25,39.37 v95.25,36.83 | v54.61,34.29 54.61,31.75 57.15,29.21 57.15,24.13 55.88,22.86 55.88,21.59 56.44,21.03 56.44,19.05 56.52,19.05 56.91,18.65 61.36,18.65 64.14,15.88 64.14,14.21
SCK  (via drill 0.3)  (5 unrouted)
  Top 0.152: JP_INPUT.3 6.35,20.32 6.35,34.29 38.1,34.29 v38.1,38.1 40.64,40.64 46.99,40.64 | 46.99,40.64 73.66,40.64 73.66,34.29 87,34.29 | 87,34.29 v87,33.5 | 87,34.29 93.98,34.29 93.98,20.32 JP_OUTPUT.3 | 46.99,40.64 v46.99,39.37
  Bottom 0.152: 37.47,35.24 37.47,38.1 v38.1,38.1 43.18,38.1 44.45,36.83 44.45,21.59 45.72,20.32 45.72,17.78 60.96,17.78 62.87,15.88 62.87,14.21 | JP_INPUT.3 4.37,20.32 4.37,16.91 12.06,16.91 12.06,15.48 | v87,33.5 87,35.32 | v46.99,39.37 49.53,39.37 50.01,39.61
SER  (via drill 0.3)  (1 unrouted)
  Top 0.152: JP_INPUT.5 4.45,25.4 4.45,36.43 33.66,36.43 v33.66,37.15
  Bottom 0.152: v33.66,37.15 33.66,35.24
VCC  (via drill 0.3)  (13 unrouted)
  Top 0.152: 67.55,21.11 87.47,21.11 87.47,23.42 91.6,23.42 91.6,10.64 99.38,10.64 99.38,17.78 99.06,17.78 | 67.55,21.11 67.55,23.42 | 67.55,21.11 55.48,21.11 v55.48,19.84 55.48,8.65 | 55.48,8.65 55.48,7.62 | 55.48,7.62 55.48,0.87 71.12,0.87 v71.12,13.97 | 37.39,8.65 37.39,2.54 16.67,2.54 16.67,7.62 | 37.39,8.65 37.39,22.86 | 37.39,22.86 37.54,22.86 37.54,23.42 36.83,23.42 37.39,22.86 | 16.67,23.42 16.67,13.57 | 16.67,13.57 16.67,7.62 | 16.67,7.62 7.62,7.62 6.35,8.89 0.95,8.89 0.95,17.78 JP_INPUT.2 | 37.39,22.86 35.64,22.86 35.64,28.65 36.59,31.27 v36.59,31.75 | 16.67,13.57 v18.89,13.57 | JP_OUTPUT.2 99.06,17.78 | 99.06,17.78 99.06,38.1 v87.63,38.1 87.63,36.83 v78.74,36.83 | 55.48,7.62 58.42,7.62 v58.42,16.51 | 37.39,8.65 55.48,8.65
  Bottom 0.152: v36.59,31.75 36.83,33.02 | 36.83,33.02 38.73,33.02 38.73,35.32 | 36.83,33.02 31.11,33.02 31.11,35.32 | JP_INPUT.2 3.81,17.78 3.81,16.51 4.37,16.03 6.35,16.03 6.35,12.14 10.79,12.14 10.79,15.48 | v18.89,13.57 18.41,13.57 18.41,15.48 | v55.48,19.84 55.48,19.92 54.61,18.41 48.26,18.41 46.99,20.32 46.99,26.67 48.26,27.94 49.45,27.94 50.01,27.38 | v78.74,36.83 78.74,35.56 80.64,35.56 80.64,35.24 | v87.63,38.1 88.27,38.1 88.27,35.32 | v58.42,16.51 60.96,16.51 61.59,15.8 61.59,14.21 | v71.12,13.97 69.45,13.97 69.22,14.21

### Text on the board
bDocu: http://electrogeek.cc/Alan numitron clock iv6.html | [Tube 1] | [Tube 3] | [Tube 3] | [Tube 1] | C1 / 1uF / (Ltch) | TD62783 | TD62783 | Dot1 | 74xx595 | 74xx595 | [IN] | C3 / 1uF / (CLK) | [OUT] | +Fil | +Fil | +Grid | +Grid | DATA | [Tube 1] | [Tube 2] | C2 / 220uF | [Tube 3] | [Tube 4] | DATA | LTCH | LTCH | CLK | Dot3 | CLK | VCC | Dot2 | VCC | GND | Dot4 | GND | LED | 74xx595 | LED | TD62783 | 74xx595 | [Tube 2] | TD62783 | [Tube 2] | [Tube 4] | Front | [Tube 4] | Alan numitron clock - IV6 (v2.0 - Jan 2017)